# Altium schematic sheet Interface.SchDoc
size A
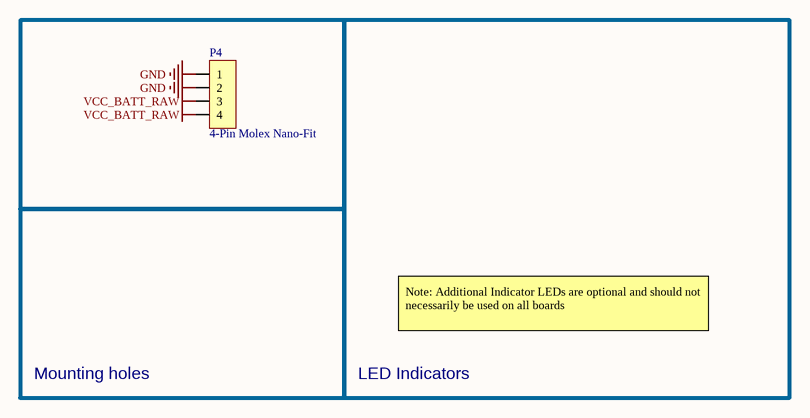
[diagram p0: Interface.SchDoc]

## Parts
P4  4-Pin Molex Nano-Fit  [MOLEX NANO-FIT 1X4]

## Nets
GND: P4.1 P4.2
VCC_BATT_RAW: P4.3 P4.4

## Notes on the sheet
- Note: Additional Indicator LEDs are optional and should not necessarily be used on all boards
- Mounting holes
- LED Indicators

## Library data of the parts
P4 = 4-Pin Nano-Fit: NanoFit RA Hdr TH SR 4Ckt; Part Number: 105313-1204; Supplier: Mouser; Manufacturer: Molex; Supplier Part Number: 538-105313-1204